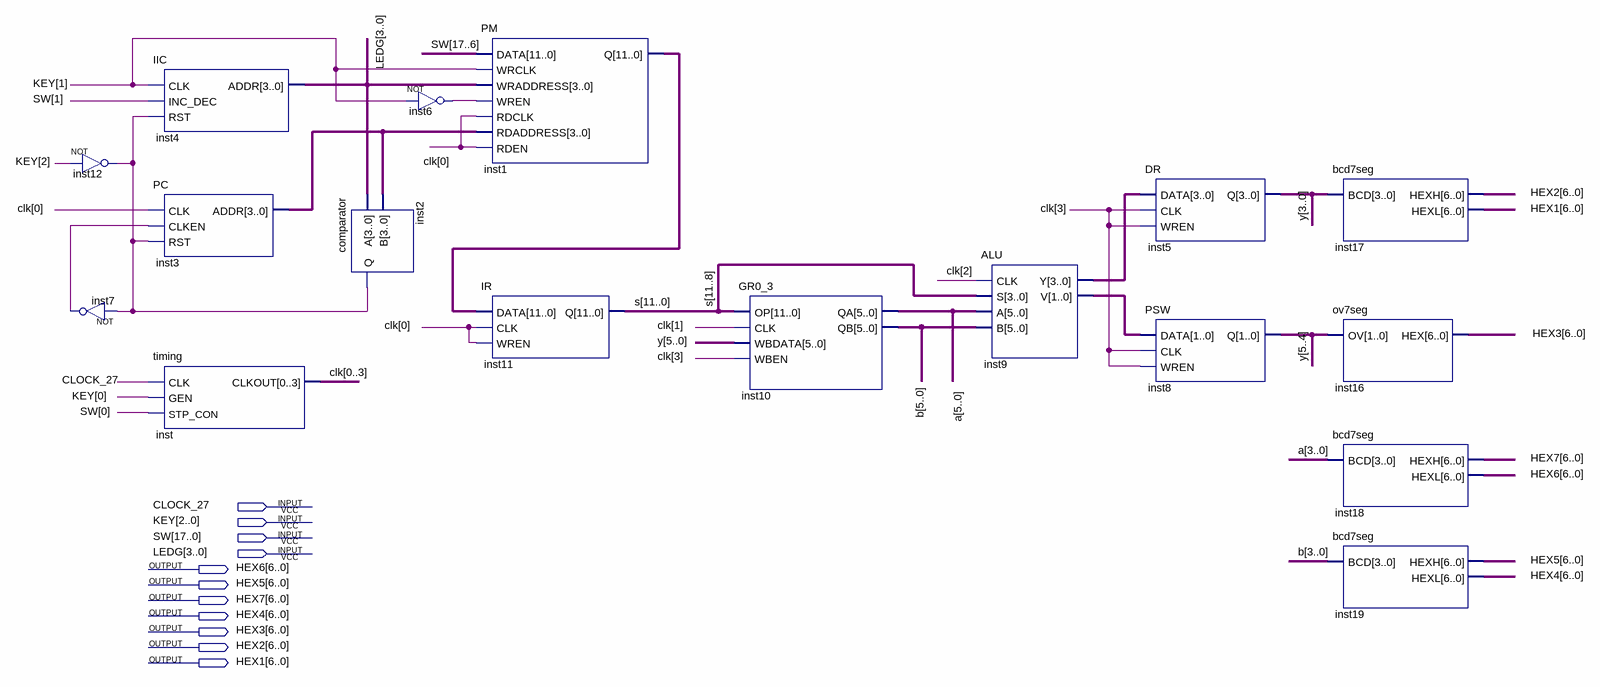
[diagram p0: schematic sheet]
// Quartus schematic CPU_6bit.bdf as structural Verilog: 17 symbols, 11 pins
module CPU_6bit (
  input  CLOCK_27,
  input  [2:0] KEY,
  input  [17:0] SW,
  input  [3:0] LEDG,
  output [6:0] HEX6,
  output [6:0] HEX5,
  output [6:0] HEX7,
  output [6:0] HEX4,
  output [6:0] HEX3,
  output [6:0] HEX2,
  output [6:0] HEX1
);

  wire inst6_out, inst7_out, inst12_out;
  wire [1:0] inst9_v;
  wire [3:0] clk, inst3_addr, inst9_y;
  wire [5:0] a, b, y;
  wire [11:0] inst1_q, s;

  not inst12 (inst12_out, KEY[2]);
  not inst7 (inst7_out, inst12_out);
  IIC inst4 (.CLK(KEY[1]), .INC_DEC(SW[1]), .RST(inst12_out), .ADDR(LEDG));
  PC inst3 (.CLK(clk[0]), .CLKEN(inst7_out), .RST(inst12_out), .ADDR(inst3_addr));
  timing inst (.CLK(CLOCK_27), .GEN(KEY[0]), .STP_CON(SW[0]), .CLKOUT({clk[0], clk[1], clk[2], clk[3]}));
  comparator inst2 (.A(LEDG), .B(inst3_addr), .Q(inst12_out));
  not inst6 (inst6_out, KEY[1]);
  PM inst1 (
    .DATA(SW[17:6]), .WRCLK(KEY[1]), .WRADDRESS(LEDG), .WREN(inst6_out), .RDCLK(clk[0]),
    .RDADDRESS(inst3_addr), .RDEN(clk[0]), .Q(inst1_q));
  IR inst11 (.DATA(inst1_q), .CLK(clk[0]), .WREN(clk[0]), .Q(s));
  GR0_3 inst10 (.OP(s), .CLK(clk[1]), .WBDATA(y), .WBEN(clk[3]), .QA(a), .QB(b));
  ALU inst9 (.CLK(clk[2]), .S(s[11:8]), .A(a), .B(b), .Y(inst9_y), .V(inst9_v));
  DR inst5 (.DATA(inst9_y), .CLK(clk[3]), .WREN(clk[3]), .Q(y[3:0]));
  PSW inst8 (.DATA(inst9_v), .CLK(clk[3]), .WREN(clk[3]), .Q(y[5:4]));
  bcd7seg inst17 (.BCD(y[3:0]), .HEXH(HEX2), .HEXL(HEX1));
  ov7seg inst16 (.OV(y[5:4]), .HEX(HEX3));
  bcd7seg inst18 (.BCD(a[3:0]), .HEXH(HEX7), .HEXL(HEX6));
  bcd7seg inst19 (.BCD(b[3:0]), .HEXH(HEX5), .HEXL(HEX4));
endmodule
